# EAGLE schematic High-Level PCB v3.0 (EAGLE 8.7.0)
TITLE: High-Level PCB
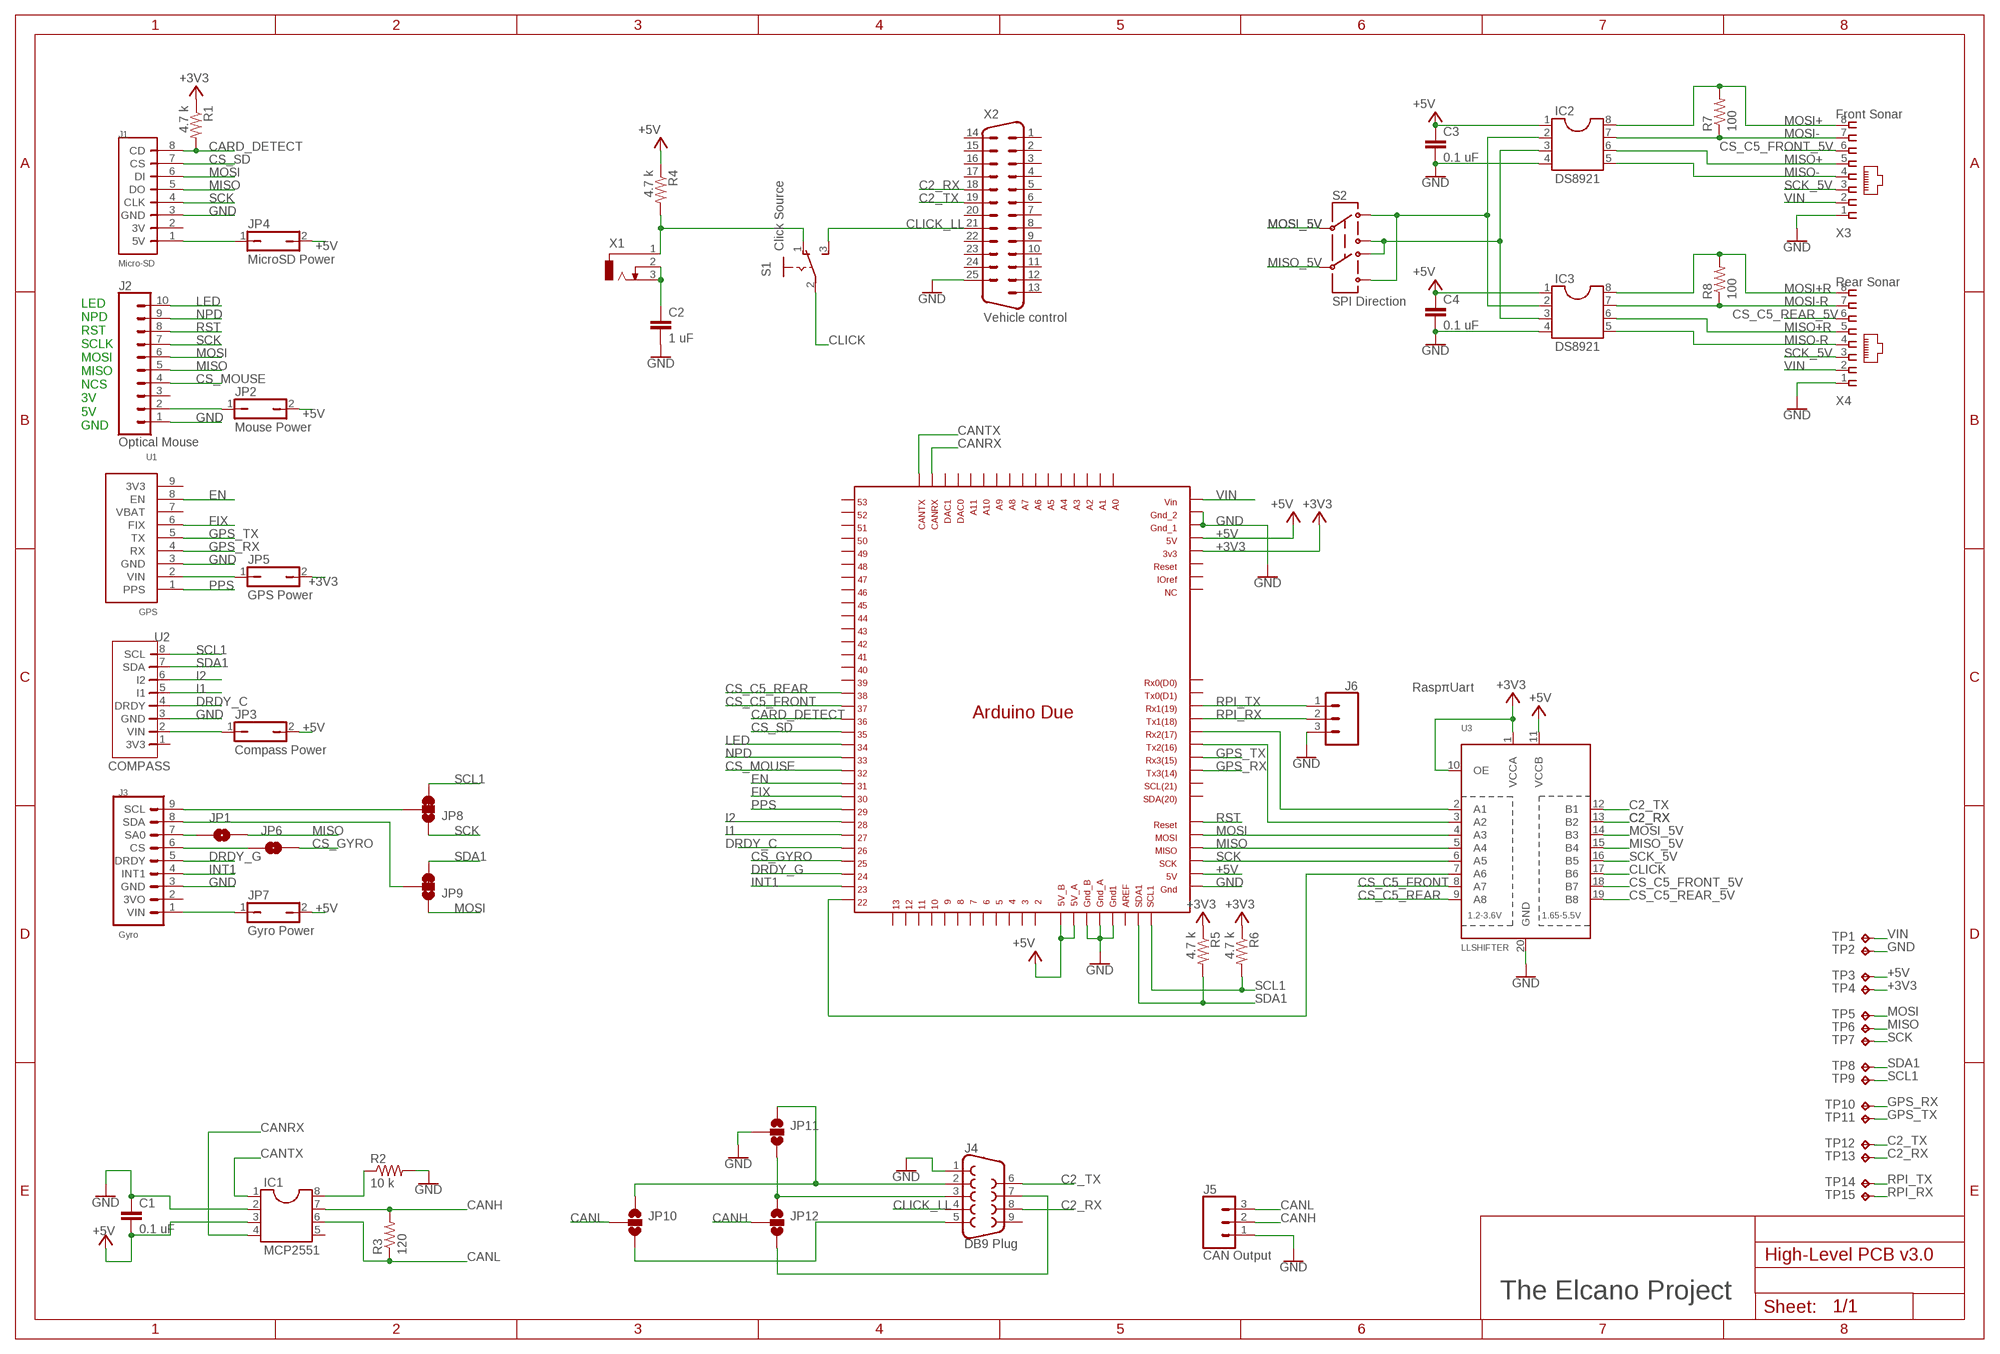
[diagram p0: schematic, sheet 1]

## Parts
C1  0.1 uF  C2.5/5  [C2.5-5]
C2  1 uF  C2.5/5  [C2.5-5]
C3  0.1 uF  C2.5/5  [C2.5-5]
C4  0.1 uF  C2.5/5  [C2.5-5]
IC1  MCP2551  DIL8  [DIL08]
IC2  DS8921  DIL8  [DIL08]
IC3  DS8921  DIL8  [DIL08]
J1  Micro-SD  MINI_SD  [ELSDCARD]
J2  Optical Mouse  CONN_10"  [1X10]
J3  Gyro  ELGYRO_L3GD20H  [ELGYRO]
J4  DB9 Plug  DB9MALE  [DB9_MALE]
J5  CAN Output  CONN_03-SCREW-5MM  [SCREWTERMINAL-5MM-3]
J6  RaspπUart  TXRX_2RSPPI  [1X03]
JP1  JUMPER-SMT_2_NO_SILK  [SMT-JUMPER_2_NO_SILK]
JP2  Mouse Power  JP1Q  [JP1]
JP3  Compass Power  JP1Q  [JP1]
JP4  MicroSD Power  JP1Q  [JP1]
JP5  GPS Power  JP1Q  [JP1]
JP6  JUMPER-SMT_2_NO_SILK  [SMT-JUMPER_2_NO_SILK]
JP7  Gyro Power  JP1Q  [JP1]
JP8  JUMPER-SMT_3_1-NC_TRACE_SILK  [SMT-JUMPER_3_1-NC_TRACE_SILK]
JP9  JUMPER-SMT_3_1-NC_TRACE_SILK  [SMT-JUMPER_3_1-NC_TRACE_SILK]
JP10  JUMPER-SMT_3_NO_SILK  [SMT-JUMPER_3_NO_SILK]
JP11  JUMPER-SMT_3_NO_SILK  [SMT-JUMPER_3_NO_SILK]
JP12  JUMPER-SMT_3_NO_SILK  [SMT-JUMPER_3_NO_SILK]
MCU1  DUE(NORMAL)  [DUE(NORMAL)]
R1  4.7 k  R-US_0204/7  [0204/7]
R2  10 k  R-US_0204/7  [0204/7]
R3  120  R-US_0204/7  [0204/7]
R4  4.7 k  R-US_0204/7  [0204/7]
R5  4.7 k  R-US_0204/7  [0204/7]
R6  4.7 k  R-US_0204/7  [0204/7]
R7  100  R-US_0204/7  [0204/7]
R8  100  R-US_0204/7  [0204/7]
S1  Click Source  ELSWITCHSP  [SP_ELSWITCH]
S2  SPI Direction  DPDT  [DPDT]
TP1  TPPAD1-17  [P1-17]
TP2  TPPAD1-17  [P1-17]
TP3  TPPAD1-17  [P1-17]
TP4  TPPAD1-17  [P1-17]
TP5  TPPAD1-17  [P1-17]
TP6  TPPAD1-17  [P1-17]
TP7  TPPAD1-17  [P1-17]
TP8  TPPAD1-17  [P1-17]
TP9  TPPAD1-17  [P1-17]
TP10  TPPAD1-17  [P1-17]
TP11  TPPAD1-17  [P1-17]
TP12  TPPAD1-17  [P1-17]
TP13  TPPAD1-17  [P1-17]
TP14  TPPAD1-17  [P1-17]
TP15  TPPAD1-17  [P1-17]
U1  GPS  ELGPS  [ELGPS]
U2  COMPASS  ELCOMPASS  [ELCOMPASS]
U3  LLSHIFTER  ELSHIFTER  [ELSHIFTER]
X1  2.5MMJACK  [2.5MMJACK]
X2  Vehicle control  M25H  [M25H]
X3  Front Sonar  RJ45-8L-B  [RJ45-NO-SHIELD]
X4  Rear Sonar  RJ45-8L-B  [RJ45-NO-SHIELD]

## Nets
+3V3 [Power]: JP5.2 MCU1.3V3 R1.1 R5.1 R6.1 TP4.TP U3.1(VCCA) U3.10(OE)
+5V [Power]: C1.2 C3.1 C4.1 IC1.3 IC2.1 IC3.1 JP2.2 JP3.2 JP4.2 JP7.2 MCU1.5V MCU1.5V_A MCU1.5V_B MCU1.GND_ICSP R4.1 TP3.TP U3.11(VCCB)
C2_RX: J4.8 TP13.TP U3.13(B2) X2.18
C2_TX: J4.6 TP12.TP U3.12(B1) X2.19
CANH: IC1.7 J5.2 JP12.2 R3.2
CANL: IC1.6 J5.3 JP10.2 R3.1
CANRX: IC1.4 MCU1.CANRX
CANTX: IC1.1 MCU1.CANTX
CARD_DETECT: J1.8(CD) MCU1.36 R1.2
CLICK: S1.2(P) U3.17(B6)
CLICK_LL: J4.4 S1.3(S) X2.21
CS_C5_FRONT: MCU1.37 U3.8(A7)
CS_C5_FRONT_5V: U3.18(B7) X3.6
CS_C5_REAR: MCU1.38 U3.9(A8)
CS_C5_REAR_5V: U3.19(B8) X4.6
CS_GYRO: JP6.2 MCU1.25
CS_MOUSE: J2.4 MCU1.32
CS_SD: J1.7(CS) MCU1.35
DRDY_C: MCU1.26 U2.4(DRDY)
DRDY_G: J3.5(DRDY) MCU1.24
EN: MCU1.31 U1.8(EN)
FIX: MCU1.30 U1.6(FIX)
GND: C1.1 C2.2 C3.2 C4.2 IC1.2 IC2.4 IC3.4 J1.3(GND) J2.1 J3.3(GND) J4.1 J5.1 J6.3 JP11.2 MCU1.5V_ICSP MCU1.GND1 MCU1.GND_1 MCU1.GND_2 MCU1.GND_A MCU1.GND_B R2.2 TP2.TP U1.3(GND) U2.3(GND) U3.20(GND) X2.25 X3.1 X4.1
GPS_RX: MCU1.TX3 TP10.TP U1.4(RX)
GPS_TX: MCU1.RX3 TP11.TP U1.5(TX)
I1: MCU1.27 U2.5(I1)
I2: MCU1.28 U2.6(I2)
INT1: J3.4(INT1) MCU1.23
LED: J2.10 MCU1.34
MISO: J1.5(DO) J2.5 JP1.2 MCU1.MISO_ICSP TP6.TP U3.5(A4)
MISO+: IC2.6 X3.5
MISO+R: IC3.6 X4.5
MISO-: IC2.5 X3.4
MISO-R: IC3.5 X4.4
MISO_5V: S2.5 U3.15(B4)
MOSI: J1.6(DI) J2.6 JP9.1 MCU1.MOSI_ICSP TP5.TP U3.4(A3)
MOSI+: IC2.8 R7.2 X3.8
MOSI+R: IC3.8 R8.2 X4.8
MOSI-: IC2.7 R7.1 X3.7
MOSI-R: IC3.7 R8.1 X4.7
MOSI_5V: S2.2 U3.14(B3)
N$1: C2.1 X1.2 X1.3
N$2: IC2.2 IC3.2 S2.1 S2.6
N$3: IC2.3 IC3.3 S2.3 S2.4
N$4: MCU1.TX2 U3.3(A2)
N$5: MCU1.RX2 U3.2(A1)
N$7: R4.2 S1.1(O) X1.1
N$8 [Power]: JP3.1 U2.2(VIN)
N$9 [Power]: J3.1(VIN) JP7.1
N$10 [Power]: J1.1(5V) JP4.1
N$11: J4.3 JP11.3 JP12.1
N$12: MCU1.22 U3.7(A6)
N$13 [Power]: J2.2 JP2.1
N$14 [Power]: JP5.1 U1.2(VIN)
N$15: J4.5 JP10.3
N$16: J4.7 JP12.3
N$17: IC1.8 R2.1
N$18: J4.2 JP10.1 JP11.1
N$19: J3.6(CS) JP6.1
N$20: J3.7(SA0) JP1.1
N$21: J3.8(SDA) JP9.2
N$22: J3.9(SCL) JP8.2
NPD: J2.9 MCU1.33
PPS: MCU1.29 U1.1(PPS)
RPI_RX: J6.2 MCU1.TX1 TP15.TP
RPI_TX: J6.1 MCU1.RX1 TP14.TP
RST: J2.8 MCU1.RESET_ICSP
SCK: J1.4(CLK) J2.7 JP8.1 MCU1.SCK_ICSP TP7.TP U3.6(A5)
SCK_5V: U3.16(B5) X3.3 X4.3
SCL1: JP8.3 MCU1.SCL1 R6.2 TP9.TP U2.8(SCL)
SDA1: JP9.3 MCU1.SDA1 R5.2 TP8.TP U2.7(SDA)
VIN [Power]: MCU1.VIN TP1.TP X3.2 X4.2
Unconnected: IC1.5 J1.2(3V) J2.3 J3.2(3VO) J4.9 MCU1.2 MCU1.3 MCU1.4 MCU1.5 MCU1.6 MCU1.7 MCU1.8 MCU1.9 MCU1.10 MCU1.11 MCU1.12 MCU1.13 MCU1.39 MCU1.40 MCU1.41 MCU1.42 MCU1.43 MCU1.44 MCU1.45 MCU1.46 MCU1.47 MCU1.48 MCU1.49 MCU1.50 MCU1.51 MCU1.52 MCU1.53 MCU1.A0 MCU1.A1 MCU1.A2 MCU1.A3 MCU1.A4 MCU1.A5 MCU1.A6 MCU1.A7 MCU1.A8 MCU1.A9 MCU1.A10 MCU1.A11 MCU1.AREF MCU1.DAC0 MCU1.DAC1 MCU1.IOREF MCU1.NC MCU1.RESET MCU1.RX0 MCU1.SCL MCU1.SDA MCU1.TX0 U1.7(VBAT) U1.9(3V3) U2.1(3V3) X2.1 X2.2 X2.3 X2.4 X2.5 X2.6 X2.7 X2.8 X2.9 X2.10 X2.11 X2.12 X2.13 X2.14 X2.15 X2.16 X2.17 X2.20 X2.22 X2.23 X2.24

## Notes on the sheet
- LED
  NPD
  RST
  SCLK
  MOSI
  MISO
  NCS
  3V
  5V
  GND
- The Elcano Project

## Library data of the parts
C1-C4 = capacitor-wima:C: CAPACITOR naming: grid - package width
IC1-IC3 = ic-package:DIL8: Dual In Line / Socket
J1 = ELCano_Footprints:MINI_SD: SD Breakoutboard footprint for ELCano Project https://learn.adafruit.com/adafruit-micro-sd-breakout-board-card-tutorial/introduction
J2 = SparkFun-Connectors:CONN_10: Multi connection point. Often used as Generic Header-pin footprint for 0.1 inch spaced/style header connections On any of the 0.1 inch spaced packages, you can populate with these: Break Away Headers - Straight <https://www.sparkfun.com/products/116> (PRT-00116) Break Away Male Headers - Right Angle <https://www.sparkfun.com/products/553> (PRT-00553) Female Headers <https://www.sparkfun.com/products/115> (PRT-00115) Break Away Headers - Machine Pin <https://www.sparkfun.com/products/117> (PRT-00117) Break Away Female Headers - Swiss Machine Pin <https://www.sparkfun.com/products/743> (PRT-00743) Arduino Stackable Header - 10 Pin <https://www.sparkfun.com/products/11376> (PRT-11376) For SCREWTERMINALS and SPRING TERMINALS visit here: Screw Terimnals on SparkFun.com <https://www.sparkfun.com/search/results?term=Screw+Terminals> (5mm/3.5mm/2.54mm spacing) This device is also useful as a general connection point to wire up your design to another part of your project. Our various solder wires solder well into these plated through hole pads. Hook-Up Wire - Assortment (Stranded, 22 AWG) <https://www.sparkfun.com/products/11375> (PRT-11375) Hook-Up Wire - Assortment (Solid Core, 22 AWG) <https://www.sparkfun.com/products/11367> (PRT-11367) View the entire wire category on our website here <https://www.sparkfun.com/categories/141> Special notes: Molex polarized connector foot print use with SKU : PRT-08231 with associated crimp pins and housings. 1MM SMD Version SKU: PRT-10208 NOTES ON THE VARIANTS LOCK and LOCK_LONGPADS... This footprint was designed to help hold the alignment of a through-hole component (i.e. 6-pin header) while soldering it into place. You may notice that each hole has been shifted either up or down by 0.005 of an inch from it's more standard position (which is a perfectly straight line). This slight alteration caused the pins (the squares in the middle) to touch the edges of the holes. Because they are alternating, it causes a "brace" to hold the component in place. 0.005 has proven to be the perfect amount of "off-center" position when using our standard breakaway headers. Although looks a little odd when you look at the bare footprint, once you have a header in there, the alteration is very hard to notice. Also,if you push a header all the way into place, it is covered up entirely on the bottom side.; PROD_ID: CONN-11563
J3 = ELCano_Footprints:ELGYRO_L3GD20H
J4 = SparkFun-Connectors:DB9: DB9 Connector Standard DB9 (D-Sub 9) serial connector. Can be used for CAN bus as well as RS485 and RS232. Footprint production proven. Here is the female version connector we sell at SparkFun: 9 Pin Female Serial Connector - PCB Mount <https://www.sparkfun.com/products/429> (PRT-00429) This connector has been used on the following SparkFun products: SparkFun RS232 Shifter - SMD <https://www.sparkfun.com/products/449> (PRT-00449) SparkFun RS232 Shifter SMD (No DB9) <https://www.sparkfun.com/products/8780> (PRT-08780); PROD_ID: CONN-09904; SPICEPREFIX: X
J5 = SparkFun-Connectors:CONN_03: Multi connection point. Often used as Generic Header-pin footprint for 0.1 inch spaced/style header connections On any of the 0.1 inch spaced packages, you can populate with these: Break Away Headers - Straight <https://www.sparkfun.com/products/116> (PRT-00116) Break Away Male Headers - Right Angle <https://www.sparkfun.com/products/553> (PRT-00553) Female Headers <https://www.sparkfun.com/products/115> (PRT-00115) Break Away Headers - Machine Pin <https://www.sparkfun.com/products/117> (PRT-00117) Break Away Female Headers - Swiss Machine Pin <https://www.sparkfun.com/products/743> (PRT-00743) Stackable Header - 3 Pin (Female, 0.1") <https://www.sparkfun.com/products/13875> (PRT-13875) For SCREWTERMINALS and SPRING TERMINALS visit here: Screw Terimnals on SparkFun.com <https://www.sparkfun.com/search/results?term=Screw+Terminals> (5mm/3.5mm/2.54mm spacing) This device is also useful as a general connection point to wire up your design to another part of your project. Our various solder wires solder well into these plated through hole pads. Hook-Up Wire - Assortment (Stranded, 22 AWG) <https://www.sparkfun.com/products/11375> (PRT-11375) Hook-Up Wire - Assortment (Solid Core, 22 AWG) <https://www.sparkfun.com/products/11367> (PRT-11367) View the entire wire category on our website here <https://www.sparkfun.com/categories/141> Special notes: Molex polarized connector foot print use with SKU : PRT-08232 with associated crimp pins and housings.; PROD_ID: CONN-10134; SF_SKU: PRT-08433
J6 = ELCano_Footprints:TXRX_2RSPPI: Multi connection point. Often used as Generic Header-pin footprint for 0.1 inch spaced/style header connections On any of the 0.1 inch spaced packages, you can populate with these: Break Away Headers - Straight <https://www.sparkfun.com/products/116> (PRT-00116) Break Away Male Headers - Right Angle <https://www.sparkfun.com/products/553> (PRT-00553) Female Headers <https://www.sparkfun.com/products/115> (PRT-00115) Break Away Headers - Machine Pin <https://www.sparkfun.com/products/117> (PRT-00117) Break Away Female Headers - Swiss Machine Pin <https://www.sparkfun.com/products/743> (PRT-00743) For SCREWTERMINALS and SPRING TERMINALS visit here: Screw Terimnals on SparkFun.com <https://www.sparkfun.com/search/results?term=Screw+Terminals> (5mm/3.5mm/2.54mm spacing) This device is also useful as a general connection point to wire up your design to another part of your project. Our various solder wires solder well into these plated through hole pads. Hook-Up Wire - Assortment (Stranded, 22 AWG) <https://www.sparkfun.com/products/11375> (PRT-11375) Hook-Up Wire - Assortment (Solid Core, 22 AWG) <https://www.sparkfun.com/products/11367> (PRT-11367) View the entire wire category on our website here <https://www.sparkfun.com/categories/141> Special notes: Molex polarized connector foot print use with: PRT-08233 with associated crimp pins and housings. 2.54_SCREWTERM for use with PRT-10571. 3.5mm Screw Terminal footprints for PRT-08084 5mm Screw Terminal footprints for use with PRT-08432
JP1 JP6 = SparkFun-Jumpers:JUMPER-SMT_2_NO: Normally open jumper This jumper has two pads in close proximity to each other. Apply solder to close the connection. Round pads are easier to solder for beginners, but are a lot larger. SparkFun Product that uses the round pads: SparkFun EL Sequencer <https://www.sparkfun.com/products/12781>
JP2-JP5 JP7 = jumper:JP1Q: JUMPER
JP8 JP9 = SparkFun-Jumpers:JUMPER-SMT_3_1-NC_TRACE: Normally closed trace jumper (1 of 2 connections) This jumper has a trace between two pads so it's normally closed (NC). The other connection is normally open (NO). Use a razor knife to open the connection. For best results follow the IPC guidelines for cutting traces: Cutout at least 0.063 mm (0.005 in). Remove all loose material to clean up the cut area. Seal the cut with an approved epoxy. Reapply solder to reclose the connection, or to close the NO connection.
JP10-JP12 = SparkFun-Jumpers:JUMPER-SMT_3_NO: Normally open jumper This jumper has three pads in close proximity to each other. Apply solder to close the connection(s).
MCU1 = DUElib130425:DUE(NORMAL)
R1 R4-R6 = resistor:R-US_: RESISTOR, American symbol
R2 R3 R7 R8 = rcl:R-US_: RESISTOR, American symbol; SPICEPREFIX: R
S1 = ELCano_Footprints:ELSWITCHSP: SLIDING SWITCH Distributor Buerklin, 11G810
S2 = ELCano_Footprints:DPDT
TP1-TP15 = testpad:TP: Test pad
U1 = ELCano_Footprints:ELGPS: FootPrint for Adafruit Ultimate GPS.
U2 = ELCano_Footprints:ELCOMPASS: ADAFRUIT LSM303DLHC COMPASS FOOT PRINT
U3 = ELCano_Footprints:ELSHIFTER: TXB0108 LEVEL SHIFTER. Foot Print for adafruit breakout board.
X1 = ELCano_Footprints:2.5MMJACK: New jack for Elcano
X2 = con-subd:M25: SUB-D; OC_FARNELL: unknown; OC_NEWARK: unknown
X3 X4 = con-tycoelectronics:RJ45: CORCOM Modular RJ Jacks No Shield Source: www.tycoelectronics.com .. ENG_DS_1654001_1099_RJ_L_0507.pdf; MF: TYCO ELECTRONICS; MPN: RJ45-8L-B; OC_FARNELL: 1279843; OC_NEWARK: 52K4445

## Net classes
1 Power: width 0.254 mm, drill 0.305 mm, clearance 0.254 mm